# Altium schematic sheet Power-Tree-Secondary.SchDoc
size A3; DocumentNumber: 5-; SheetNumber: 5; SheetTotal: 7
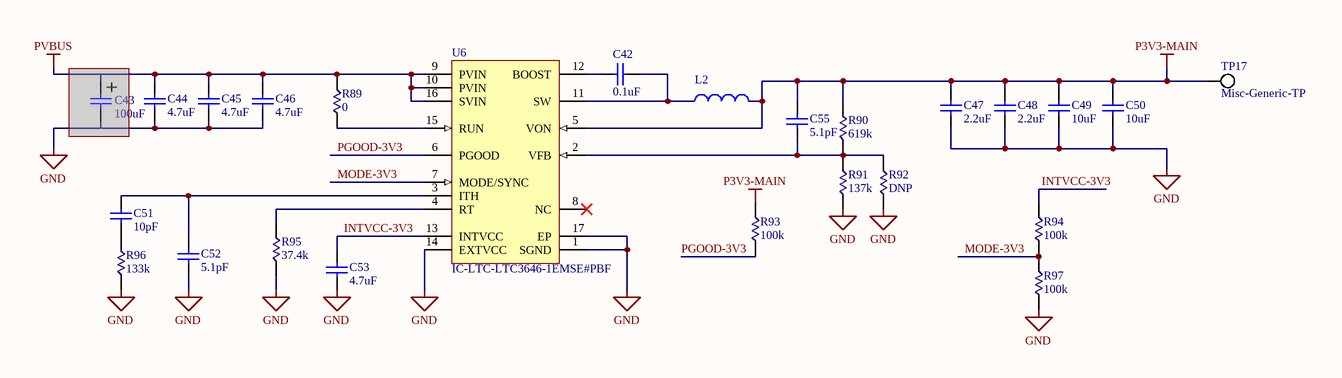
[diagram p0: Power-Tree-Secondary.SchDoc]

## Parts
C42  value 0.1uF  [FOOTPRINT-0805-GEN]  (hidden comment: Capacitor-Generic-0805)
C43  value 100uF  [FOOTPRINT-NIPPON-JA0]  (hidden comment: Capacitor-Nippon-HHXC350ARA470MF80G)  (masked out: inside a compile mask, not in the netlist)
C44  value 4.7uF  [FOOTPRINT-1206-GEN]  (hidden comment: C1206C475K5RACAUTO)
C45  value 4.7uF  [FOOTPRINT-1206-GEN]  (hidden comment: C1206C475K5RACAUTO)
C46  value 4.7uF  [FOOTPRINT-1206-GEN]  (hidden comment: C1206C475K5RACAUTO)
C47  value 2.2uF  [FOOTPRINT-0805-GEN]  (hidden comment: C0805C225K8PAC)
C48  value 2.2uF  [FOOTPRINT-0805-GEN]  (hidden comment: C0805C225K8PAC)
C49  value 10uF  [FOOTPRINT-0805-GEN]  (hidden comment: C0805C106K8PAC)
C50  value 10uF  [FOOTPRINT-0805-GEN]  (hidden comment: C0805C106K8PAC)
C51  value 10pF  [FOOTPRINT-0805-GEN]  (hidden comment: C0805C100J3HACTU)
C52  value 5.1pF  [FOOTPRINT-0805-GEN]  (hidden comment: C0805C519K5GACTU)
C53  value 4.7uF  [FOOTPRINT-0805-GEN]  (hidden comment: C0805C475K8PAC)
C55  value 5.1pF  [FOOTPRINT-0805-GEN]  (hidden comment: C0805C519K5GACTU)
L2  Inductor-Bourns-SRP7050TA-2R2M  [FOOTPRINT-BOURNS-SRP7050TA]  (value not drawn)
R89  value 0  [FOOTPRINT-0805-GEN]  (hidden comment: SMC)
R90  value 619k  [FOOTPRINT-0805-GEN]  (hidden comment: SMC)
R91  value 137k  [FOOTPRINT-0805-GEN]  (hidden comment: SMC)
R92  value DNP  [FOOTPRINT-0805-GEN]  (hidden comment: Trim, 0 ohm)
R93  value 100k  [FOOTPRINT-0805-GEN]  (hidden comment: SMC)
R94  value 100k  [FOOTPRINT-0805-GEN]  (hidden comment: SMC)
R95  value 37.4k  [FOOTPRINT-0805-GEN]  (hidden comment: SMC)
R96  value 133k  [FOOTPRINT-0805-GEN]  (hidden comment: SMC)
R97  value 100k  [FOOTPRINT-0805-GEN]  (hidden comment: SMC)
TP17  Misc-Generic-TP  [FOOTPRINT-GENERIC-TP-VIA-1MM5]
U6  IC-LTC-LTC3646-1EMSE#PBF  [FOOTPRINT-LTC-LTC3646]

## Nets
GND: C44.1 C45.1 C46.1 C47.2 C48.2 C49.1 C50.1 C52.1 C53.1 R91.2 R92.2 R95.1 R96.1 R97.1 U6.1(SGND) U6.14(EXTVCC) U6.17(EP)
P3V3-MAIN: C47.1 C48.1 C49.2 C50.2 C55.2 L2.2 R90.2 R93.2 TP17.1(TP) U6.5(VON)
PVBUS: C44.2 C45.2 C46.2 R89.1 U6.9(PVIN) U6.10(PVIN) U6.16(SVIN)
INTVCC-3V3: C53.2 R94.2 U6.13(INTVCC)
MODE-3V3: R94.1 R97.2 U6.7(MODE/SYNC)
PGOOD-3V3: R93.1 U6.6(PGOOD)
NetC42_1: C42.1 L2.1 U6.11(SW)
NetC42_2: C42.2 U6.12(BOOST)
NetC51_1: C51.1 R96.2
NetC51_2: C51.2 C52.2 U6.3(ITH)
NetC55_1: C55.1 R90.1 R91.1 R92.1 U6.2(VFB)
NetR89_2: R89.2 U6.15(RUN)
NetR95_2: R95.2 U6.4(RT)

Not connected (* = marked no-connect by the designer): U6 8(NC)*

## Notes on the sheet
- Title
- Size:
- Date:
- Engineer
- A3
- Number:
- Sheet
- of
- Approved
- Revision:
- UC Riverside
- www.highlanderracing.org <http://www.highlanderracing.org>
- File:
- (in symbol Capacitor-Nippon-HHXC350ARA470MF80G) +

## Library data of the parts
C42 C52 C55 = Capacitor-Generic-0805: Capacitor; Published: 8-Jun-2000; LatestRevisionDate: 17-Jul-2002; LatestRevisionNote: Re-released for DXP Platform.; PackageReference: RAD-0.3; Publisher: Altium Limited; PackageDescription: Radial Cap, Thru-Hole; 2 Leads; 0.3 in Pin Spacing
C43 = Capacitor-Nippon-HHXC350ARA470MF80G: CAP ALUM POLY 100UF 20% 50V SMD
C44-C46 = Capacitor-Generic-1206: CAP CER 1206 4.7UF 50V X7R 10%; Published: 8-Jun-2000; LatestRevisionDate: 17-Jul-2002; LatestRevisionNote: Re-released for DXP Platform.; PackageReference: RAD-0.3; Publisher: Altium Limited; PackageDescription: Radial Cap, Thru-Hole; 2 Leads; 0.3 in Pin Spacing
C47 C48 = Capacitor-Generic-0805: CAP CER 2.2UF 10V X5R 0805; Published: 8-Jun-2000; LatestRevisionDate: 17-Jul-2002; LatestRevisionNote: Re-released for DXP Platform.; PackageReference: RAD-0.3; Publisher: Altium Limited; PackageDescription: Radial Cap, Thru-Hole; 2 Leads; 0.3 in Pin Spacing
C49 C50 = Capacitor-Generic-0805: CAP CER 10UF 10V X5R 0805; Published: 8-Jun-2000; LatestRevisionDate: 17-Jul-2002; LatestRevisionNote: Re-released for DXP Platform.; PackageReference: RAD-0.3; Publisher: Altium Limited; PackageDescription: Radial Cap, Thru-Hole; 2 Leads; 0.3 in Pin Spacing
C51 = Capacitor-Generic-0805: CAP CER 0805 10PF 25V ULTRA STAB; Published: 8-Jun-2000; LatestRevisionDate: 17-Jul-2002; LatestRevisionNote: Re-released for DXP Platform.; PackageReference: RAD-0.3; Publisher: Altium Limited; PackageDescription: Radial Cap, Thru-Hole; 2 Leads; 0.3 in Pin Spacing
C53 = Capacitor-Generic-0805: CAP CER 4.7UF 10V X5R 0805; Published: 8-Jun-2000; LatestRevisionDate: 17-Jul-2002; LatestRevisionNote: Re-released for DXP Platform.; PackageReference: RAD-0.3; Publisher: Altium Limited; PackageDescription: Radial Cap, Thru-Hole; 2 Leads; 0.3 in Pin Spacing
L2 = Inductor-Bourns-SRP7050TA-2R2M: FIXED IND 2.2UH 10A 12 MOHM SMD
R89-R97 = Resistor-Generic-0805-2012: 1/8 Watt Surface Mount Resistor
U6 = IC-LTC-LTC3646-1EMSE#PBF: 1 A Synchronous Step-Down Converter, 16-pin SOP (MSE-16-EDP), -40 to 85 degC, Pb-Free; PartNumber: LTC3646EMSE#PBF; Manufacturer: Linear Technology; Number of Outputs: 1; Frequency Adjust Range: 200kHz - 3MHz; ComponentLink3Description: Package Specification; PackageReference: MSE-16; ComponentLink2URL: http://cds.linear.com/docs/en/datasheet/36461fa.pdf; ComponentLink1Description: Manufacturer URL; RoHS: TRUE; ComponentLink3URL: http://cds.linear.com/docs/en/packaging/05081667_F_MSE16.pdf; PackageVersion: Rev. F, 05/2013; Mounting Technology: Surface Mount; ComponentLink1URL: http://www.linear.com/; ComponentLink2Description: Datasheet; PackageDescription: 16-Pin Plastic MSOP, Exposed Die Pad, Body 4.039 x 3 mm, Pitch 0.5 mm